# EAGLE design BeatleBoy (EAGLE 9.2.0)
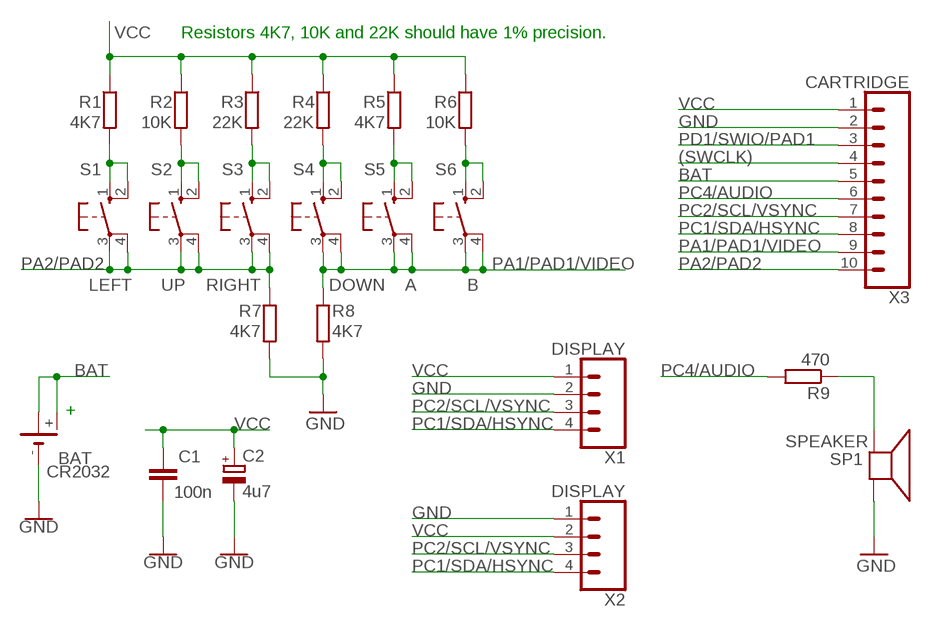
[diagram p0: schematic, sheet 1]

## Parts
BAT  CR2032  CR2032H  [CR2032H]
C1  100n  C-EU025-024X044  [C025-024X044]
C2  4u7  CPOL-EUE2-4  [E2-4]
R1  4K7  R-EU_0204/2V  [0204V]
R2  10K  R-EU_0204/2V  [0204V]
R3  22K  R-EU_0204/2V  [0204V]
R4  22K  R-EU_0204/2V  [0204V]
R5  4K7  R-EU_0204/2V  [0204V]
R6  10K  R-EU_0204/2V  [0204V]
R7  4K7  R-EU_0204/2V  [0204V]
R8  4K7  R-EU_0204/2V  [0204V]
R9  470  R-EU_0204/2V  [0204V]
S1  LEFT  10-XXB3F-10XXB  [B3F-10XXB]
S2  UP  10-XXB3F-10XXB  [B3F-10XXB]
S3  RIGHT  10-XXB3F-10XXB  [B3F-10XXB]
S4  DOWN  10-XXB3F-10XXB  [B3F-10XXB]
S5  A  10-XXB3F-10XXB  [B3F-10XXB]
S6  B  10-XXB3F-10XXB  [B3F-10XXB]
SP1  SPEAKER  SPEAKER/AL60P  [AL60P]
X1  DISPLAY  CONN_04  [1X04]
X2  DISPLAY  CONN_04  [1X04]
X3  CARTRIDGE  CONN_10  [1X10_LONGPADS]

## Nets
(SWCLK): X3.4
A: R5.2 S5.1(S) S5.2(S1)
B: R6.2 S6.1(S) S6.2(S1)
BAT: BAT.+ BAT.+@1(+) X3.5
DOWN: R4.2 S4.1(S) S4.2(S1)
GND: BAT.- C1.2 C2.- R7.2 R8.2 SP1.2(-) X1.2 X2.1 X3.2
LEFT: R1.2 S1.1(S) S1.2(S1)
N$2: R9.1 SP1.1(+)
PA1/PAD1/VIDEO: R8.1 S4.3(P) S4.4(P1) S5.3(P) S5.4(P1) S6.3(P) S6.4(P1) X3.9
PA2/PAD2: R7.1 S1.3(P) S1.4(P1) S2.3(P) S2.4(P1) S3.3(P) S3.4(P1) X3.10
PC1/SDA/HSYNC: X1.4 X2.4 X3.8
PC2/SCL/VSYNC: X1.3 X2.3 X3.7
PC4/AUDIO: R9.2 X3.6
PD1/SWIO/PAD1: X3.3
RIGHT: R3.2 S3.1(S) S3.2(S1)
UP: R2.2 S2.1(S) S2.2(S1)
VCC: C1.1 C2.+ R1.1 R2.1 R3.1 R4.1 R5.1 R6.1 X1.1 X2.2 X3.1

## Notes on the sheet
- Resistors 4K7, 10K and 22K should have 1% precision.
- +

## Library data of the parts
BAT = battery:CR2032H: LI BATTERY Varta
C1 = rcl:C-EU: CAPACITOR, European symbol; SPICEPREFIX: C
C2 = rcl:CPOL-EU: POLARIZED CAPACITOR, European symbol; SPICEPREFIX: C
R1-R9 = rcl:R-EU_: RESISTOR, European symbol; SPICEPREFIX: R
S1-S6 = switch-omron2:10-XX: OMRON SWITCH
SP1 = adafruit_watch:SPEAKER: SPEAKER Source: Buerklin Added PS12 (for part # PS1240 piezo) http://www.ladyada.net/library/pcb/eaglelibrary.html
X1 X2 = SparkFun-Connectors:CONN_04: Multi connection point. Often used as Generic Header-pin footprint for 0.1 inch spaced/style header connections On any of the 0.1 inch spaced packages, you can populate with these: Break Away Headers - Straight <https://www.sparkfun.com/products/116> (PRT-00116) Break Away Male Headers - Right Angle <https://www.sparkfun.com/products/553> (PRT-00553) Female Headers <https://www.sparkfun.com/products/115> (PRT-00115) Break Away Headers - Machine Pin <https://www.sparkfun.com/products/117> (PRT-00117) Break Away Female Headers - Swiss Machine Pin <https://www.sparkfun.com/products/743> (PRT-00743) For SCREWTERMINALS and SPRING TERMINALS visit here: Screw Terimnals on SparkFun.com <https://www.sparkfun.com/search/results?term=Screw+Terminals> (5mm/3.5mm/2.54mm spacing) This device is also useful as a general connection point to wire up your design to another part of your project. Our various solder wires solder well into these plated through hole pads. Hook-Up Wire - Assortment (Stranded, 22 AWG) <https://www.sparkfun.com/products/11375> (PRT-11375) Hook-Up Wire - Assortment (Solid Core, 22 AWG) <https://www.sparkfun.com/products/11367> (PRT-11367) View the entire wire category on our website here <https://www.sparkfun.com/categories/141> Special notes: Molex polarized connector foot print use with SKU : PRT-08231 with associated crimp pins and housings. 1MM SMD Version SKU: PRT-10208; PROD_ID: CONN-09696
X3 = SparkFun-Connectors:CONN_10: Multi connection point. Often used as Generic Header-pin footprint for 0.1 inch spaced/style header connections On any of the 0.1 inch spaced packages, you can populate with these: Break Away Headers - Straight <https://www.sparkfun.com/products/116> (PRT-00116) Break Away Male Headers - Right Angle <https://www.sparkfun.com/products/553> (PRT-00553) Female Headers <https://www.sparkfun.com/products/115> (PRT-00115) Break Away Headers - Machine Pin <https://www.sparkfun.com/products/117> (PRT-00117) Break Away Female Headers - Swiss Machine Pin <https://www.sparkfun.com/products/743> (PRT-00743) Arduino Stackable Header - 10 Pin <https://www.sparkfun.com/products/11376> (PRT-11376) For SCREWTERMINALS and SPRING TERMINALS visit here: Screw Terimnals on SparkFun.com <https://www.sparkfun.com/search/results?term=Screw+Terminals> (5mm/3.5mm/2.54mm spacing) This device is also useful as a general connection point to wire up your design to another part of your project. Our various solder wires solder well into these plated through hole pads. Hook-Up Wire - Assortment (Stranded, 22 AWG) <https://www.sparkfun.com/products/11375> (PRT-11375) Hook-Up Wire - Assortment (Solid Core, 22 AWG) <https://www.sparkfun.com/products/11367> (PRT-11367) View the entire wire category on our website here <https://www.sparkfun.com/categories/141> Special notes: Molex polarized connector foot print use with SKU : PRT-08231 with associated crimp pins and housings. 1MM SMD Version SKU: PRT-10208 NOTES ON THE VARIANTS LOCK and LOCK_LONGPADS... This footprint was designed to help hold the alignment of a through-hole component (i.e. 6-pin header) while soldering it into place. You may notice that each hole has been shifted either up or down by 0.005 of an inch from it's more standard position (which is a perfectly straight line). This slight alteration caused the pins (the squares in the middle) to touch the edges of the holes. Because they are alternating, it causes a "brace" to hold the component in place. 0.005 has proven to be the perfect amount of "off-center" position when using our standard breakaway headers. Although looks a little odd when you look at the bare footprint, once you have a header in there, the alteration is very hard to notice. Also,if you push a header all the way into place, it is covered up entirely on the bottom side.

## Board
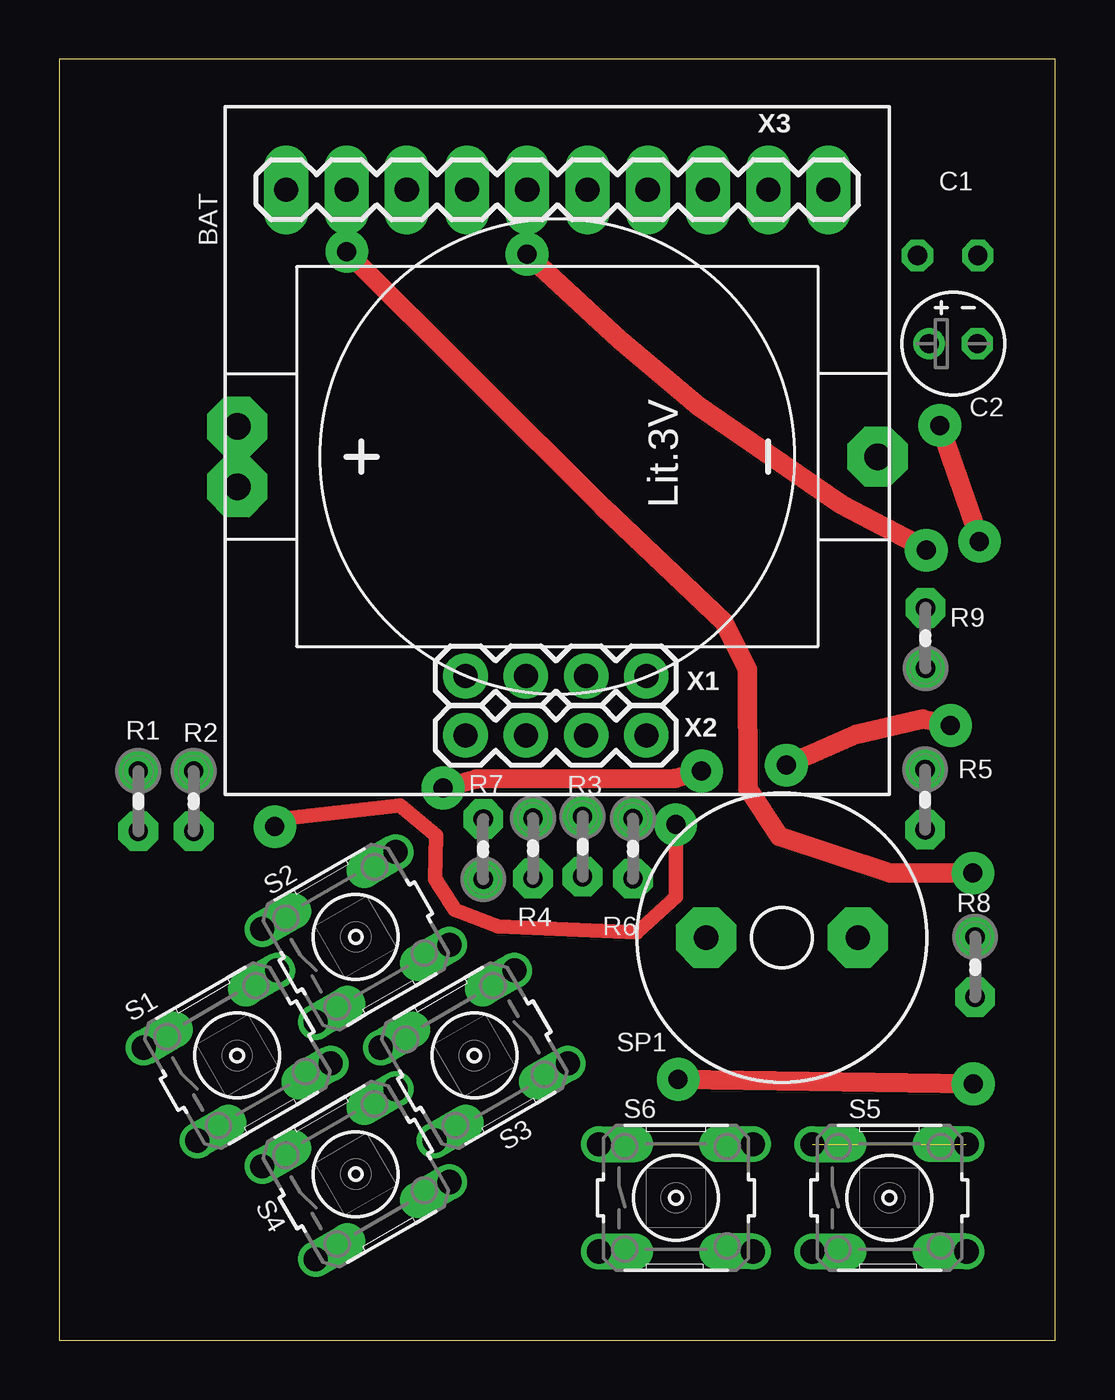
[diagram p1: board, top side]
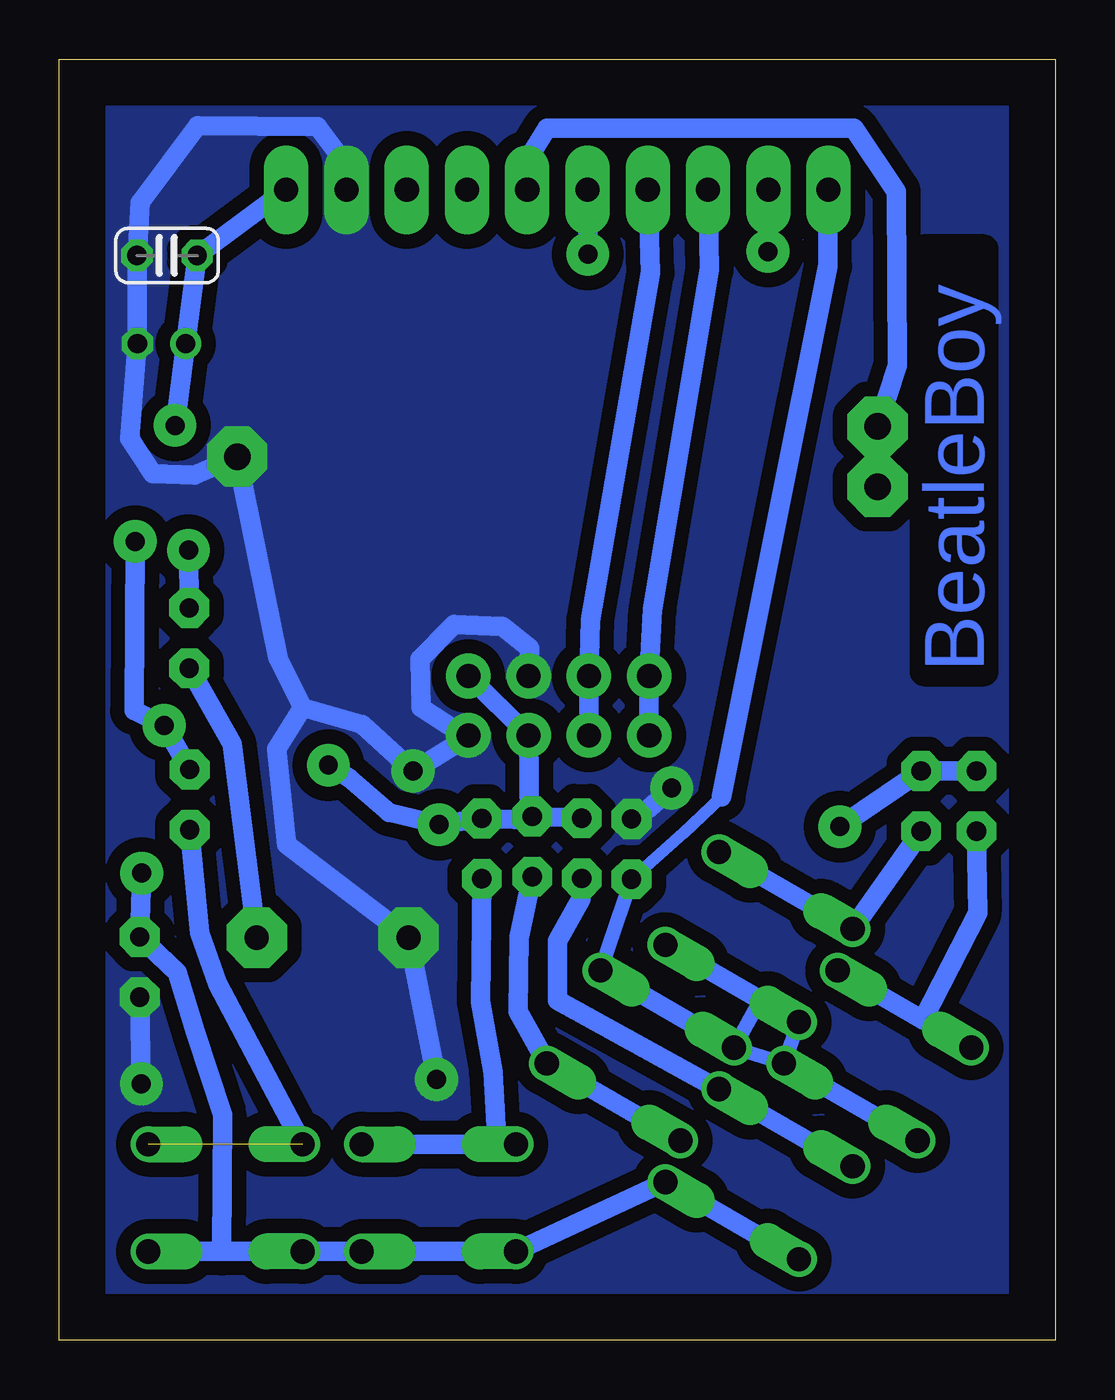
[diagram p2: board, bottom side, seen from below]

Size 42 x 54 mm. Coordinates in mm from the lower left corner, seen from the top.
Outline: 0,0 42,0 42,54 0,54 0,0
Copper layers (1*16): Top 0.035mm / dielectric 1.5mm / Bottom 0.035mm
Design rules "default": minimum track width 6mil, minimum drill 0.35mm, track to track 6mil, track to pad 6mil, pad to pad 6mil, via to via 6mil, smd to smd 6mil, copper to edge 40mil, drill to drill 6mil, minimum pad ring 10mil, minimum via ring 8mil, stop-mask expansion 4mil, vias tented up to drill 0mil, thermal gap 10mil

### Footprints (pad centres in the part's own frame; a part is rotated, then mirrored left to right if it is on the bottom)
CR2032H = drill 1.118 pad 2.54 octagon: + 1.27,13.5; +@1 -1.27,13.5; - 0,-13.5
C025-024X044 = drill 0.813 octagon: 1 -1.27,0; 2 1.27,0
E2-4 = drill 0.813 pad 1.27: + -1.016,0 | drill 0.813 pad 1.27 octagon: - 1.016,0
0204V = drill 0.813 pad 1.676 octagon: 1 -1.27,0; 2 1.27,0
B3F-10XXB = drill 1.016 offset: 1 -3.251,2.261; 2 3.251,2.261; 3 -3.251,-2.261; 4 3.251,-2.261
AL60P = drill 1.016 pad 2.54 octagon: 1 -3.2,0; 2 3.2,0
1X04 = drill 1.016 pad 1.88: 1 0,0; 2 2.54,0; 3 5.08,0; 4 7.62,0
1X10_LONGPADS = drill 1.016 pad 1.88 long: 1 -11.43,0; 2 -8.89,0; 3 -6.35,0; 4 -3.81,0; 5 -1.27,0; 6 1.27,0; 7 3.81,0; 8 6.35,0; 9 8.89,0; 10 11.43,0

### Placement (x,y rotation side)
BAT  21,37.25 90 top
C1  37.46,45.73 180 bottom
C2  37.69,42.01 0 top
R1  3.33,22.73 270 top
R2  5.66,22.73 270 top
R3  22.06,20.81 270 top
R4  19.97,20.74 270 top
R5  36.5,22.79 270 top
R6  24.18,20.72 270 top
R7  17.87,20.7 90 top
R8  38.61,15.73 270 top
R9  36.52,29.6 90 top
S1  7.5,12 30 top
S2  12.5,17 30 top
S3  17.5,12 210 top
S4  12.5,7 30 top
S5  35,6 0 top
S6  26,6 0 top
SP1  30.47,16.97 180 top
X1  24.75,28 180 top
X2  24.75,25.5 180 top
X3  21,48.5 180 top

### Tracks (layer width: path | path; a pad name or v marks a point on that pad's centre or on a via)
A  (1 unrouted)
  Bottom 0.813: S5.1 35.33,15.01 36.08,17.18 R5.2
B
  Bottom 0.813: S6.2 23.55,8.26 | 23.55,8.26 S6.1 | R6.2 24.23,14.27 23.72,11.31 23.55,8.26
BAT
  Bottom 0.813: X3.5 22.21,49.84 21.45,51.09 8.51,51.09 6.71,48.43 6.68,41.09 BAT.+ BAT.+@1
DOWN
  Bottom 0.813: S4.1 S4.2 20.99,14.32 20.99,16.82 20.01,18.61 R4.2
GND  (via drill 0.8 pad 1.8)
  Top 0.813: v38.54,10.8 v26.09,10.99 | v16.18,23.28 17.59,23.66 25.96,23.69 v27.08,24
  Bottom 0.508: X2.1 24.81,25.41 | 38.54,10.76 v38.54,10.8
  Bottom 0.813: 31.73,26.67 29.24,25.95 v27.08,24 24.81,25.41 26.75,26.68 26.78,28.71 25.36,30.18 23.32,30.09 22.17,29.18 X1.2 | 31.73,26.67 32.83,24.92 32.42,20.9 SP1.2 v26.09,10.99 | R8.2 38.54,10.76 | X3.2 29.97,49.64 31.1,51.15 36.18,51.2 38.59,47.95 C1.2 C2.- 39.03,38.01 38.06,36.53 36.3,36.47 BAT.- 32.77,28.73 31.73,26.67 | R7.2 17.12,22.43 v16.18,23.28
  pour Bottom (isolate 0.61, no thermals): 2,2 2,52 40,52 40,2
LEFT
  Bottom 0.813: S1.1 5.6,13.51 | 5.6,13.51 S1.2 | R1.2 3.28,18.01 5.6,13.51
N$2
  Bottom 0.813: R9.1 34.7,25.13 SP1.1
PA1/PAD1/VIDEO  (via drill 0.8 pad 1.8)
  Top 0.813: v38.52,19.69 35.02,19.69 30.37,21.23 29.02,23.27 29.01,28.27 28.02,30.29 22.92,35.12 v12.12,45.9
  Bottom 0.813: S4.3 S4.4 S6.3 S6.4 S5.3 35.15,3.74 | 35.15,3.74 S5.4 | 35.15,3.74 35.12,9.49 36.25,12.96 37.02,15.5 R8.1 v38.52,19.69 | v12.12,45.9 X3.9
PA2/PAD2
  Bottom 0.508: 14.08,22.9 15.68,21.39 R7.1
  Bottom 0.61: R7.1 S3.3 | S2.3 S1.4 S3.4 12.44,14.35
  Bottom 0.813: S1.3 S1.4 | S3.4 S3.3 | S2.3 12.44,14.35 S2.4 | 14.08,22.9 9.59,45.29 X3.10
PC1/SDA/HSYNC
  Bottom 0.813: X2.4 X1.4 16.98,30.79 14.59,45.15 X3.8
PC2/SCL/VSYNC
  Bottom 0.813: X2.3 X1.3 19.61,30.37 17.07,45.01 X3.7
PC4/AUDIO  (via drill 0.8 pad 1.8)
  Top 0.508: 36.11,33.59 v36.55,33.3
  Top 0.813: 36.11,33.59 32.98,35.23 26.94,39.38 23.62,42.19 v19.72,45.78
  Bottom 0.813: v36.55,33.3 R9.2 | v19.72,45.78 X3.6
RIGHT
  Bottom 0.813: S3.2 S3.1 22.67,13.85 22.62,16.95 R3.2
UP
  Bottom 0.813: S2.2 S2.1 R2.2
VCC  (via drill 0.8 pad 1.8)
  Top 0.508: 38.84,33.67 v38.8,33.67 | 9.71,22.02 v9.09,21.65
  Top 0.61: v25.99,21.74 25.99,18.68 24.36,17.19 18.49,17.45 16.68,18.13 15.84,19.45 15.89,21.28 14.36,22.54 9.71,22.02
  Top 0.813: v37.12,38.56 38.84,33.67 | v30.66,24.24 33.59,25.54 36.4,26.18 v37.57,25.92
  Bottom 0.508: R3.1 22.18,21.94
  Bottom 0.813: R1.1 R2.1 v9.09,21.65 | X1.1 X2.2 22.18,21.94 R6.1 v25.99,21.74 28.09,22.25 29.79,23.71 v30.66,24.24 | R3.1 R4.1 | X3.1 C1.1 C2.+ v37.12,38.56 | v38.8,33.67 38.85,26.54 v37.57,25.92 R5.1

### Text on the board
Bottom: BeatleBoy
Document: 10 | 1 | SDA-SCL-GND-VCC | SDA-SCL-VCC-GND